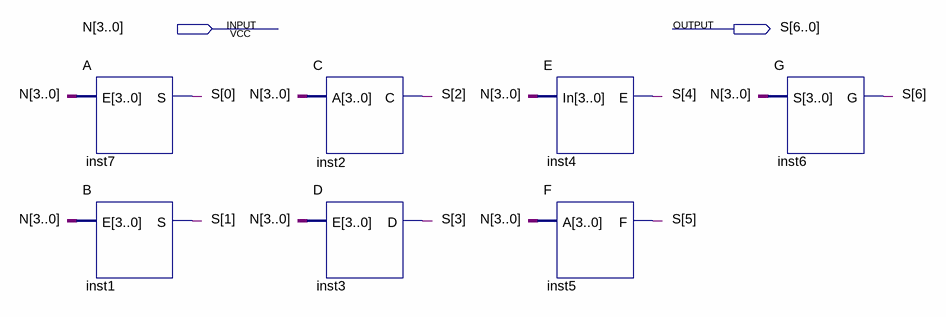
[diagram p0: schematic sheet]
// Quartus schematic C7S.bdf as structural Verilog: 7 symbols, 2 pins
module C7S (
  input  [3:0] N,
  output [6:0] S
);

  A inst7 (.E(N), .S(S[0]));
  B inst1 (.E(N), .S(S[1]));
  C inst2 (.A(N), .C(S[2]));
  D inst3 (.E(N), .D(S[3]));
  E inst4 (.In(N), .E(S[4]));
  F inst5 (.A(N), .F(S[5]));
  G inst6 (.S(N), .G(S[6]));
endmodule
